# EasyEDA schematic MeinMarlin.json

## Sheets
1 STEPPER: TITLE: Sheet_1; REV: 1.0; Date: 2020-07-07; Sheet: 1/1; Drawn By: LindnerM; Company: Your Company
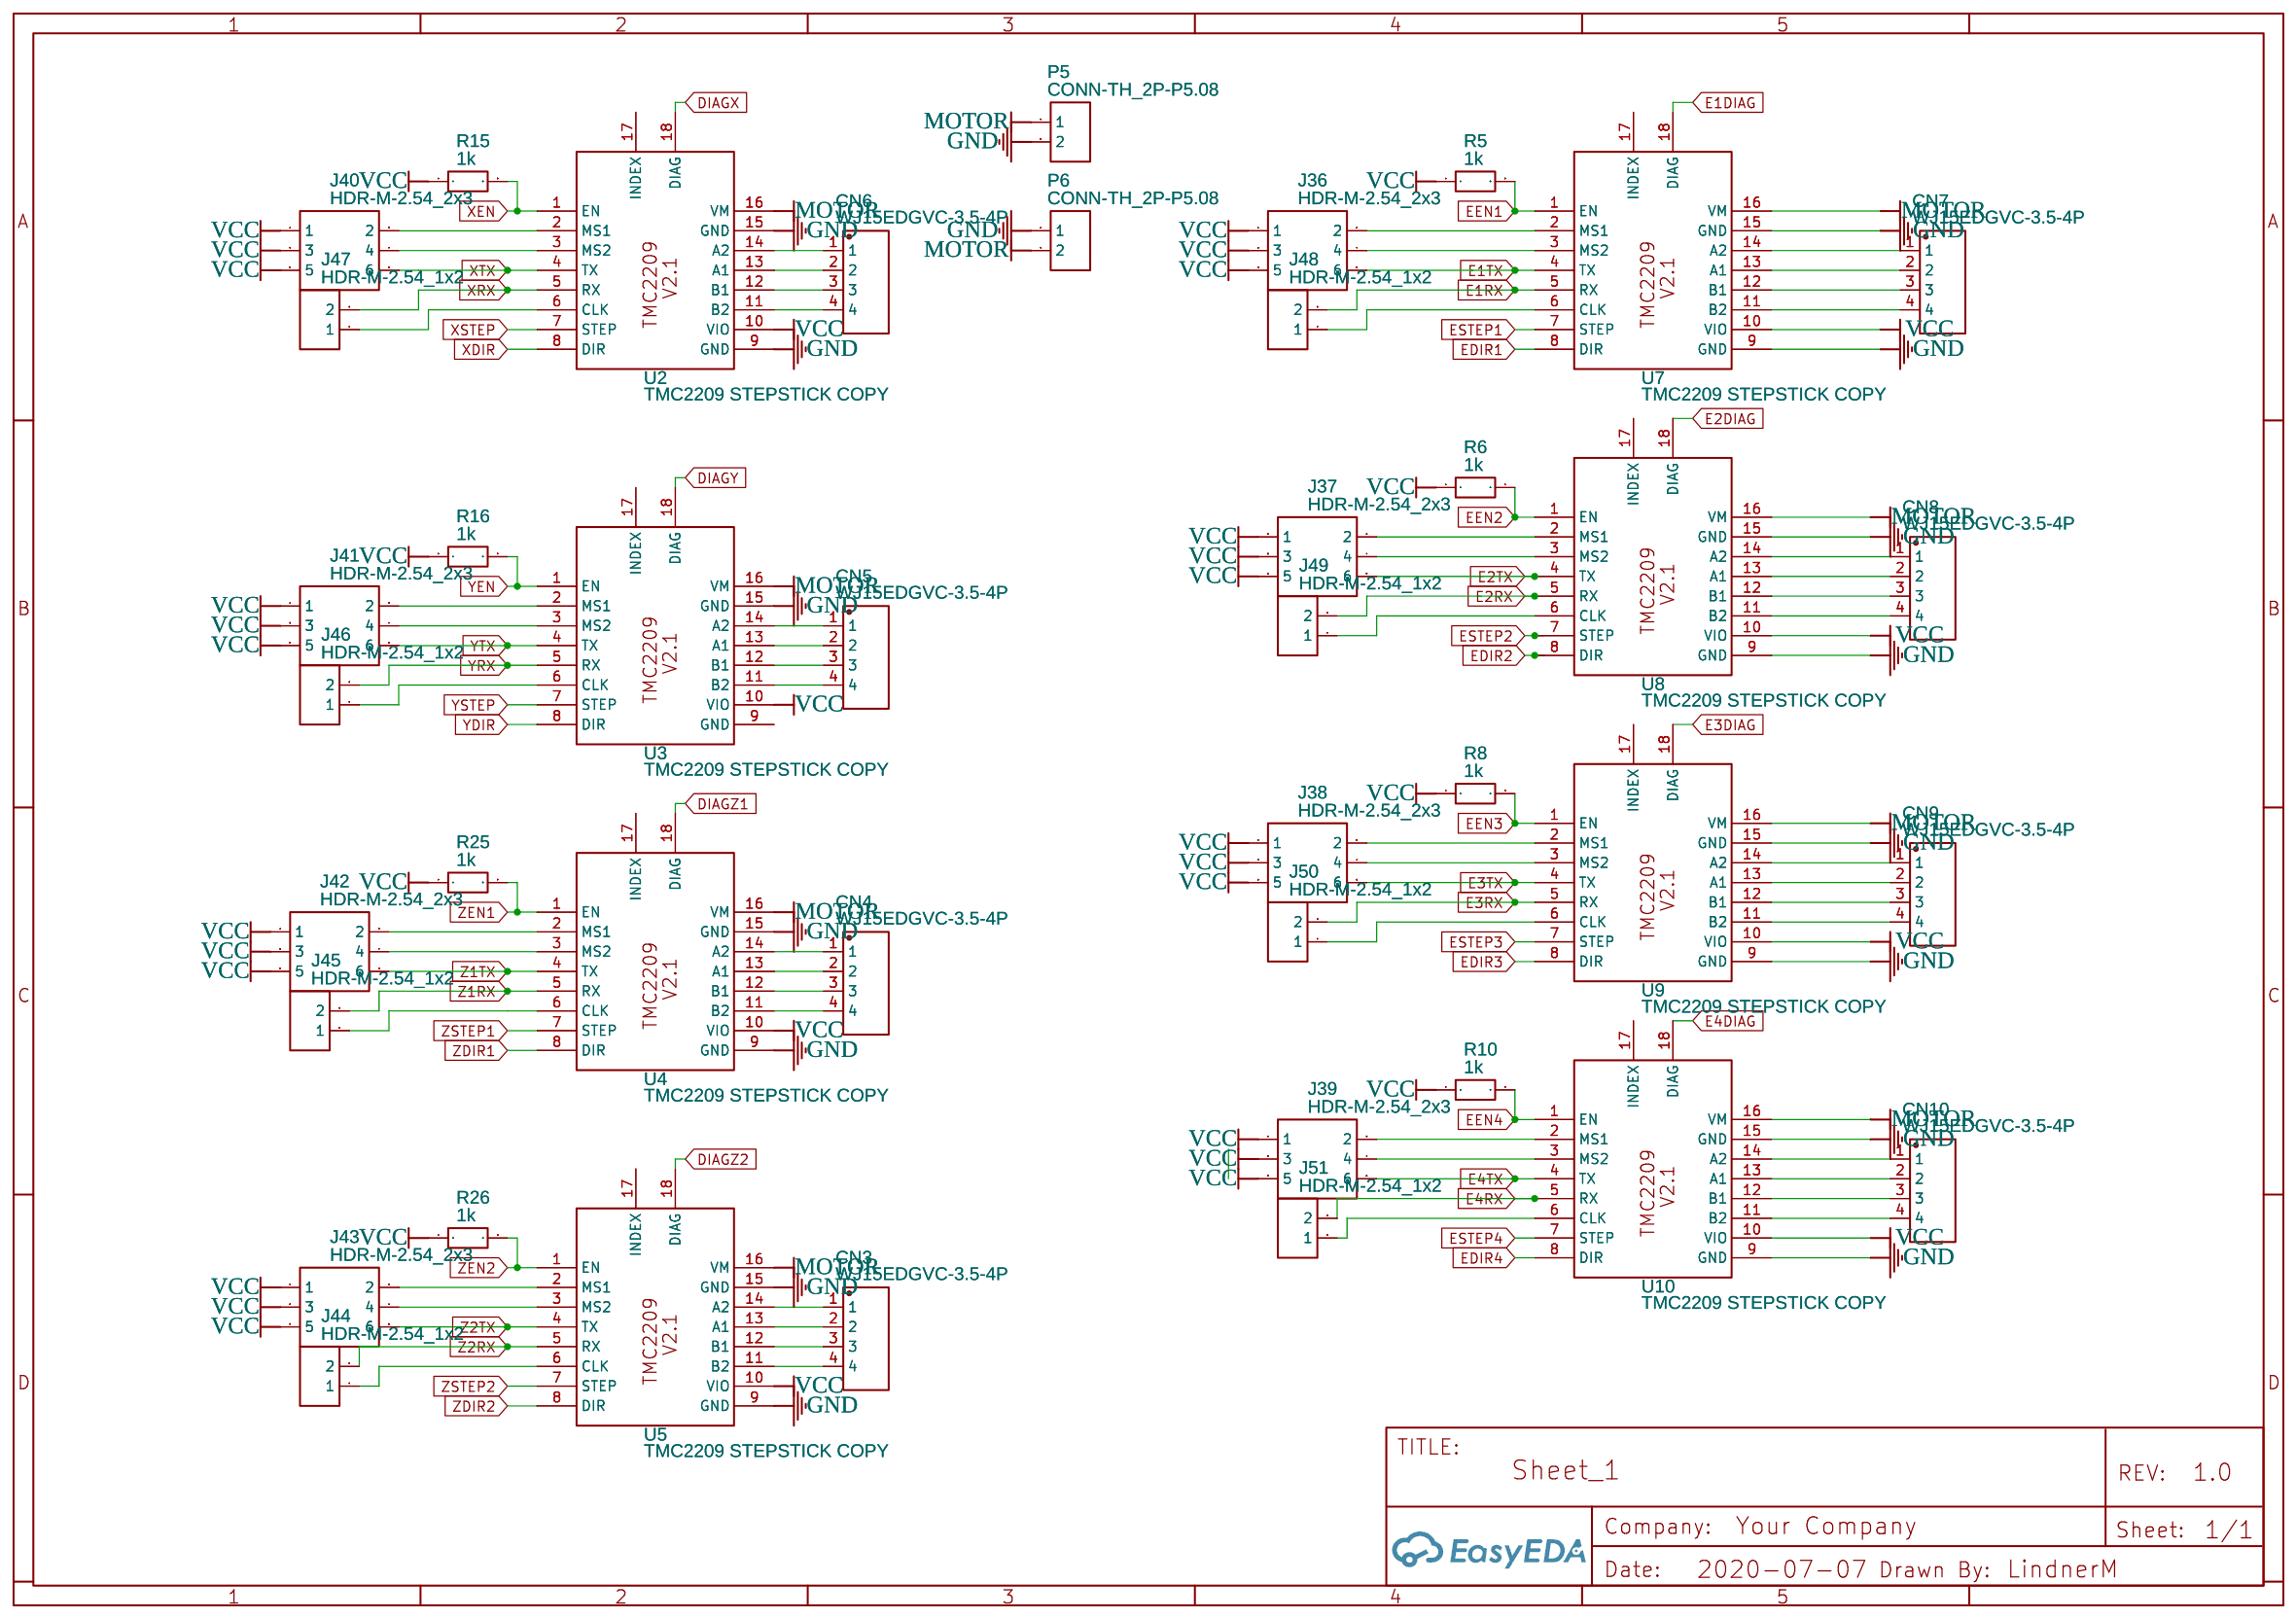
[diagram p0: STEPPER]
2 FAN_HEAT_TEMP: TITLE: Sheet_2; Date: 2020-07-08
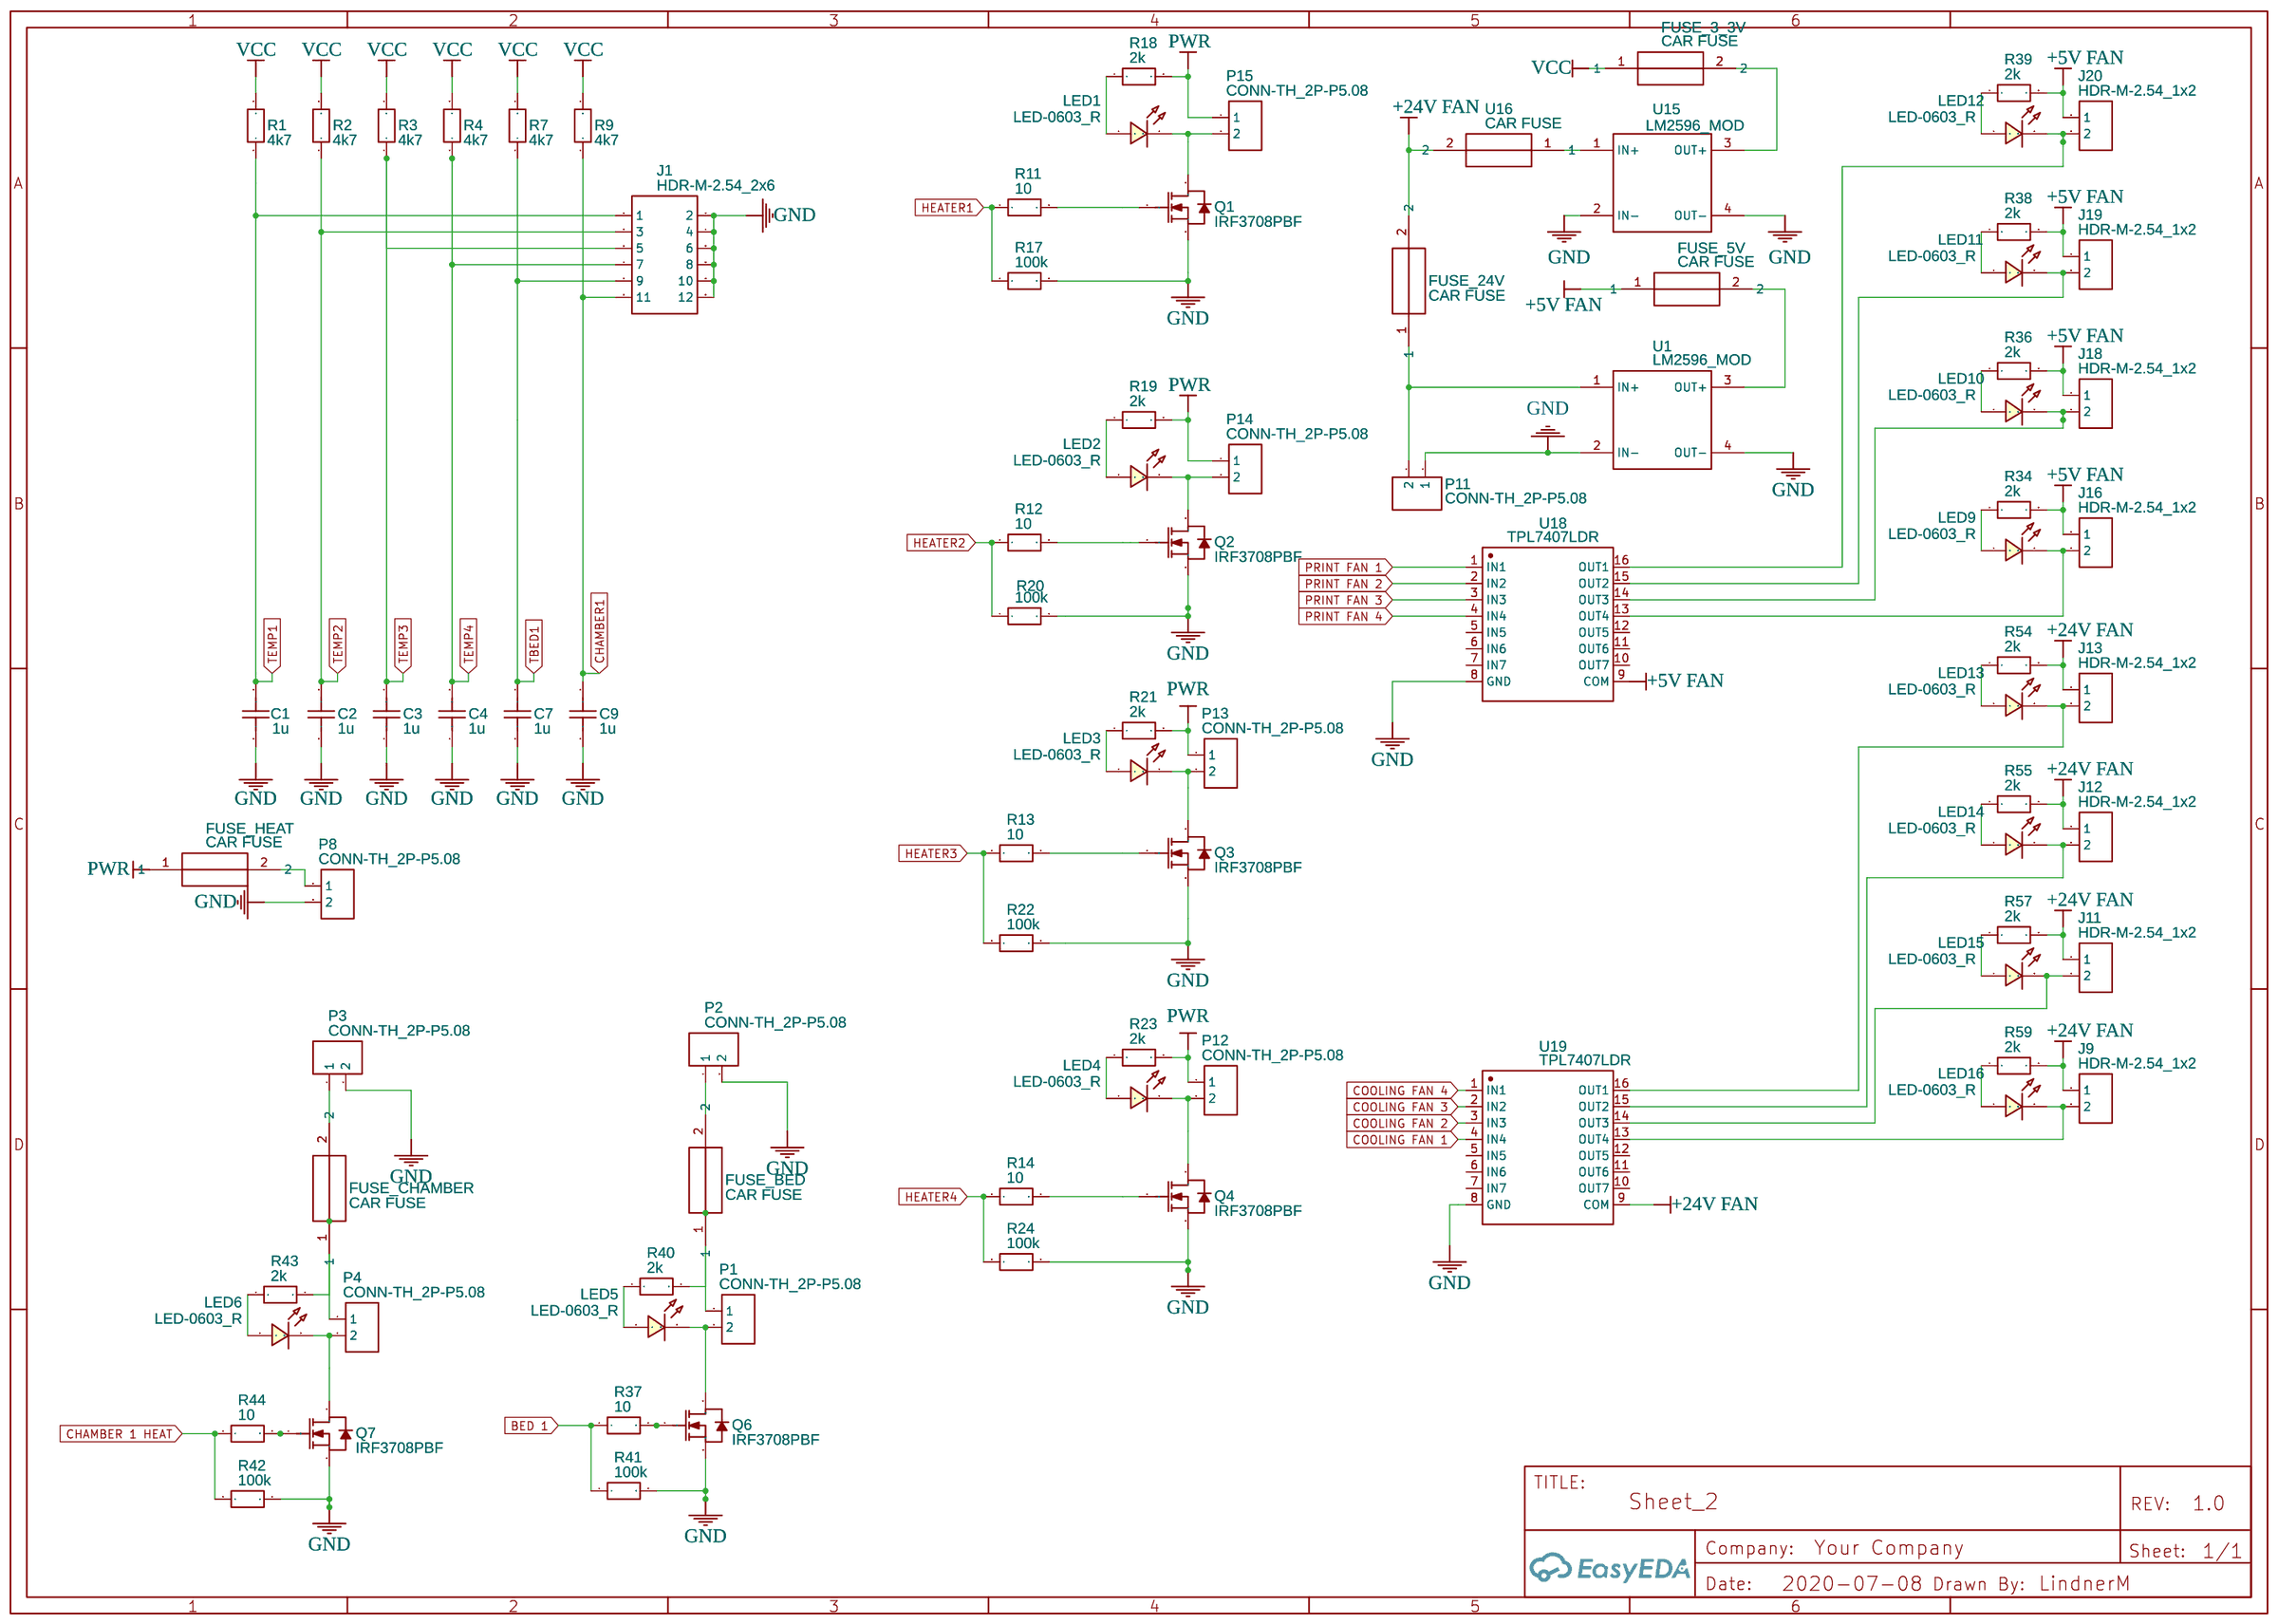
[diagram p1: FAN_HEAT_TEMP]
3 SENSOR: TITLE: Sheet_3; Date: 2020-07-08
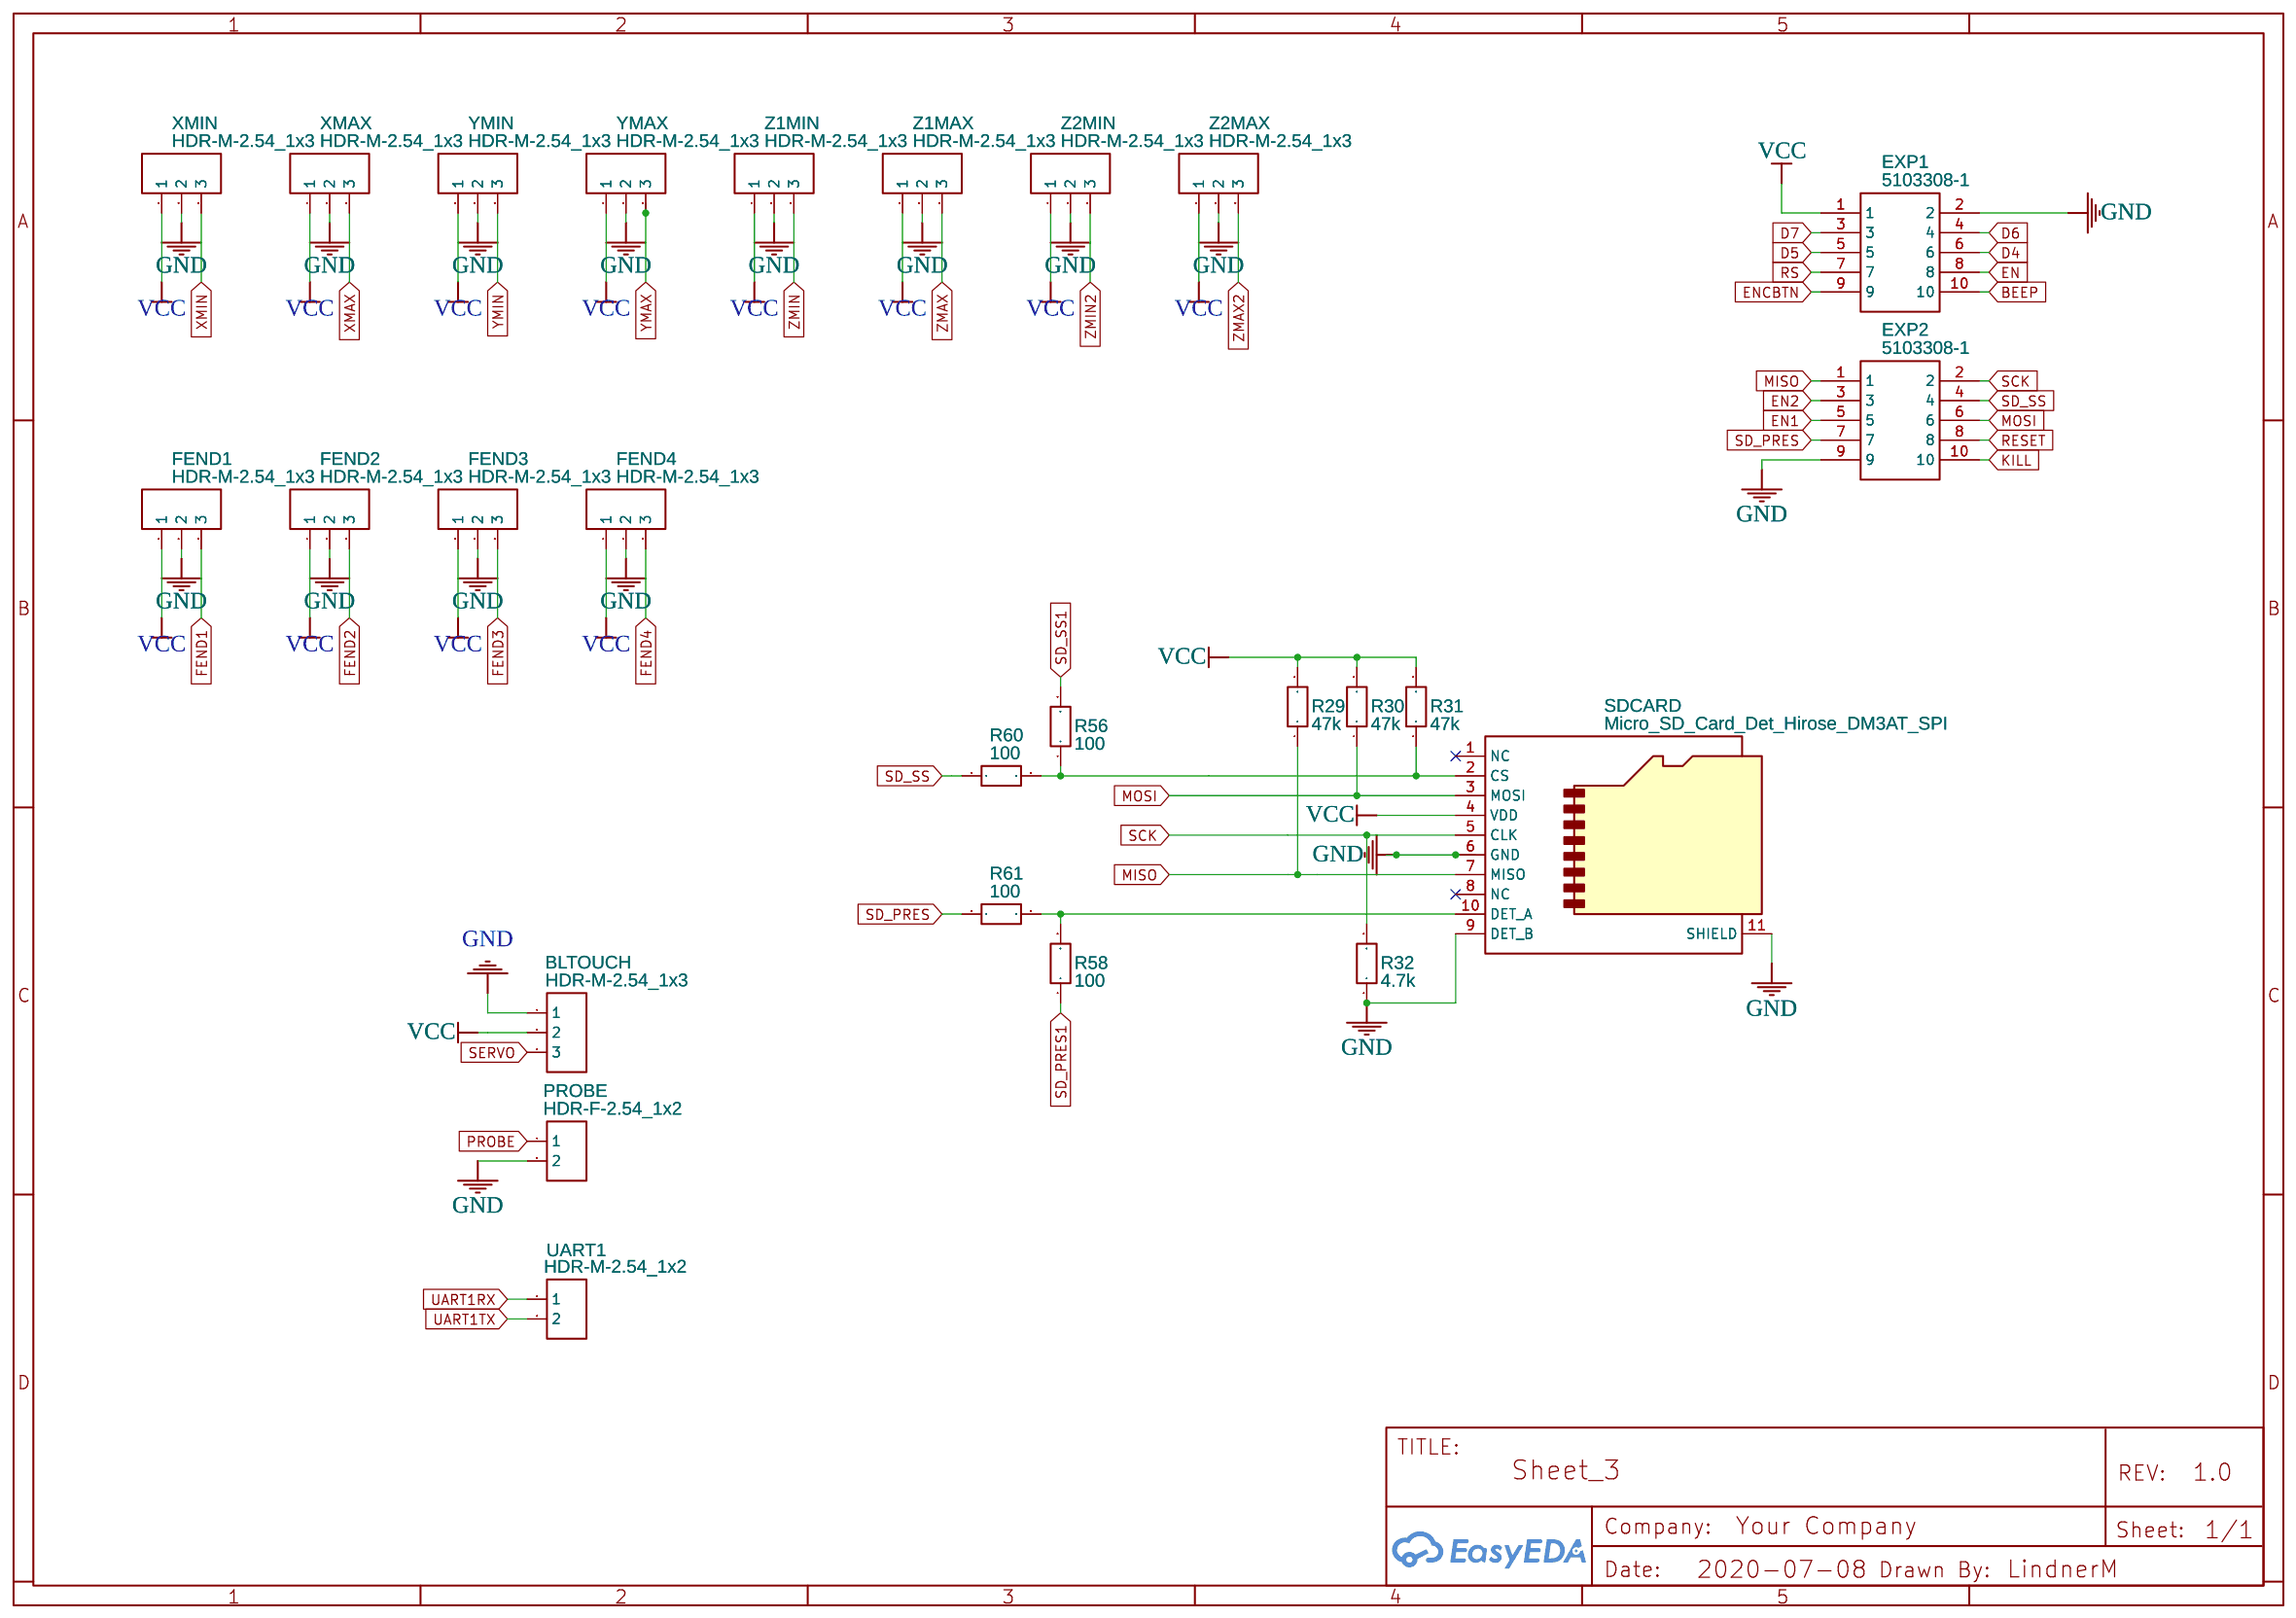
[diagram p2: SENSOR]
4 MCU: TITLE: Sheet_2; Date: 2020-07-17
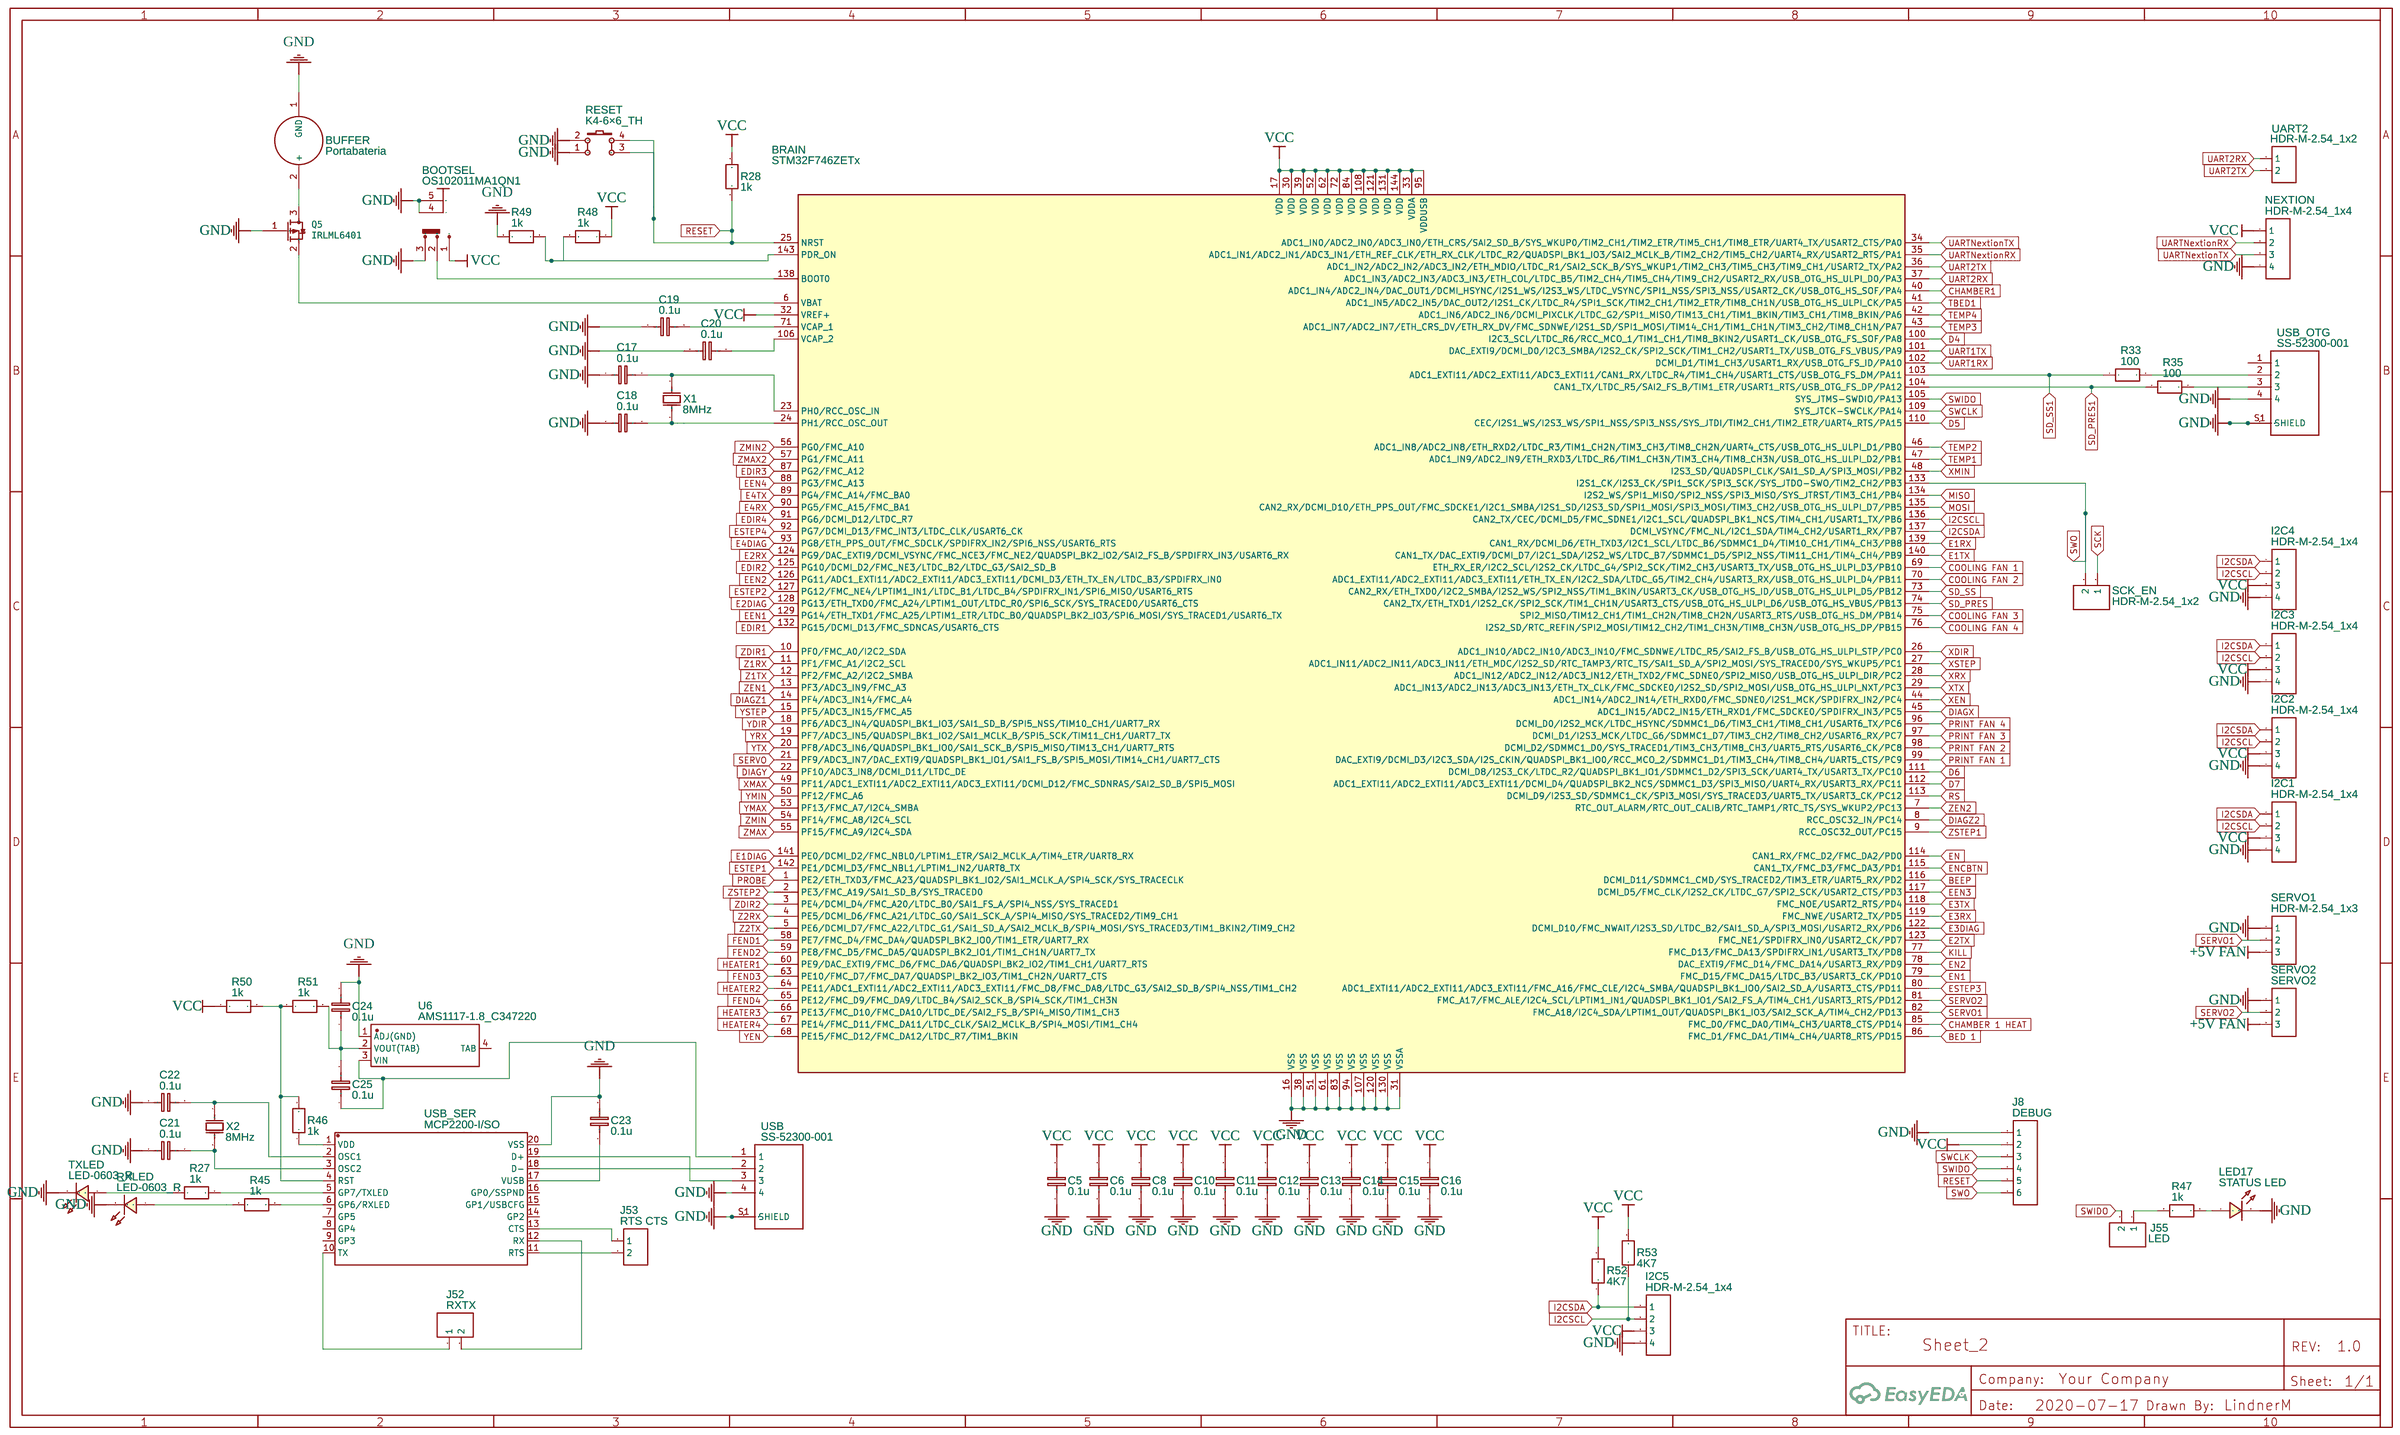
[diagram p3: MCU]

## Parts
sheet FAN_HEAT_TEMP
C1  1u  [C1206]
C2  1u  [C1206]
C3  1u  [C1206]
C4  1u  [C1206]
C7  1u  [C1206]
C9  1u  [C1206]
FUSE_3_3V  CAR FUSE  [SICHERUNG]
FUSE_5V  CAR FUSE  [SICHERUNG]
FUSE_24V  CAR FUSE  [SICHERUNG]
FUSE_BED  CAR FUSE  [SICHERUNG]
FUSE_CHAMBER  CAR FUSE  [SICHERUNG]
FUSE_HEAT  CAR FUSE  [SICHERUNG]
J1  HDR-M-2.54_2x6  [HDR-M-2.54_2X6]
J9  HDR-M-2.54_1x2  [HDR-M-2.54_1X2]
J11  HDR-M-2.54_1x2  [HDR-M-2.54_1X2]
J12  HDR-M-2.54_1x2  [HDR-M-2.54_1X2]
J13  HDR-M-2.54_1x2  [HDR-M-2.54_1X2]
J16  HDR-M-2.54_1x2  [HDR-M-2.54_1X2]
J18  HDR-M-2.54_1x2  [HDR-M-2.54_1X2]
J19  HDR-M-2.54_1x2  [HDR-M-2.54_1X2]
J20  HDR-M-2.54_1x2  [HDR-M-2.54_1X2]
LED1  LED-0603_R  [LED1206-RD]
LED2  LED-0603_R  [LED1206-RD]
LED3  LED-0603_R  [LED1206-RD]
LED4  LED-0603_R  [LED1206-RD]
LED5  LED-0603_R  [LED1206-RD]
LED6  LED-0603_R  [LED1206-RD]
LED9  LED-0603_R  [LED1206-RD]
LED10  LED-0603_R  [LED1206-RD]
LED11  LED-0603_R  [LED1206-RD]
LED12  LED-0603_R  [LED1206-RD]
LED13  LED-0603_R  [LED1206-RD]
LED14  LED-0603_R  [LED1206-RD]
LED15  LED-0603_R  [LED1206-RD]
LED16  LED-0603_R  [LED1206-RD]
P1  CONN-TH_2P-P5.08  [CONN-TH_2P-P5.08]
P2  CONN-TH_2P-P5.08  [CONN-TH_2P-P5.08]
P3  CONN-TH_2P-P5.08  [CONN-TH_2P-P5.08]
P4  CONN-TH_2P-P5.08  [CONN-TH_2P-P5.08]
P8  CONN-TH_2P-P5.08  [CONN-TH_2P-P5.08]
P11  CONN-TH_2P-P5.08  [CONN-TH_2P-P5.08]
P12  CONN-TH_2P-P5.08  [CONN-TH_2P-P5.08]
P13  CONN-TH_2P-P5.08  [CONN-TH_2P-P5.08]
P14  CONN-TH_2P-P5.08  [CONN-TH_2P-P5.08]
P15  CONN-TH_2P-P5.08  [CONN-TH_2P-P5.08]
Q1  IRF3708PBF  [TO-220-3_L10.0-W4.5-P2.54-L]
Q2  IRF3708PBF  [TO-220-3_L10.0-W4.5-P2.54-L]
Q3  IRF3708PBF  [TO-220-3_L10.0-W4.5-P2.54-L]
Q4  IRF3708PBF  [TO-220-3_L10.0-W4.5-P2.54-L]
Q6  IRF3708PBF  [TO-220-3_L10.0-W4.5-P2.54-L]
Q7  IRF3708PBF  [TO-220-3_L10.0-W4.5-P2.54-L]
R1  4k7  [R1206]
R2  4k7  [R1206]
R3  4k7  [R1206]
R4  4k7  [R1206]
R7  4k7  [R1206]
R9  4k7  [R1206]
R11  10  [R1206]
R12  10  [R1206]
R13  10  [R1206]
R14  10  [R1206]
R17  100k  [R1206]
R18  2k  [R1206]
R19  2k  [R1206]
R20  100k  [R1206]
R21  2k  [R1206]
R22  100k  [R1206]
R23  2k  [R1206]
R24  100k  [R1206]
R34  2k  [R1206]
R36  2k  [R1206]
R37  10  [R1206]
R38  2k  [R1206]
R39  2k  [R1206]
R40  2k  [R1206]
R41  100k  [R1206]
R42  100k  [R1206]
R43  2k  [R1206]
R44  10  [R1206]
R54  2k  [R1206]
R55  2k  [R1206]
R57  2k  [R1206]
R59  2k  [R1206]
U1  LM2596_MOD  [LM2596S EBAY]
U15  LM2596_MOD  [LM2596S EBAY]
U16  CAR FUSE  [SICHERUNG]
U18  TPL7407LDR  [SOIC-16_L9.9-W3.9-P1.27-LS6.0-BL]
U19  TPL7407LDR  [SOIC-16_L9.9-W3.9-P1.27-LS6.0-BL]
sheet MCU
BOOTSEL  OS102011MA1QN1  [SW-TH_OS102011MA1QN1]
BRAIN  STM32F746ZETx  [LQFP144]
BUFFER  Portabateria  [PORTABATERIA]
C5  0.1u  [C1206]
C6  0.1u  [C1206]
C8  0.1u  [C1206]
C10  0.1u  [C1206]
C11  0.1u  [C1206]
C12  0.1u  [C1206]
C13  0.1u  [C1206]
C14  0.1u  [C1206]
C15  0.1u  [C1206]
C16  0.1u  [C1206]
C17  0.1u  [C1206]
C18  0.1u  [C1206]
C19  0.1u  [C1206]
C20  0.1u  [C1206]
C21  0.1u  [C1206]
C22  0.1u  [C1206]
C23  0.1u  [C1206]
C24  0.1u  [C1206]
C25  0.1u  [C1206]
I2C1  HDR-M-2.54_1x4  [HDR-M-2.54_1X4]
I2C2  HDR-M-2.54_1x4  [HDR-M-2.54_1X4]
I2C3  HDR-M-2.54_1x4  [HDR-M-2.54_1X4]
I2C4  HDR-M-2.54_1x4  [HDR-M-2.54_1X4]
I2C5  HDR-M-2.54_1x4  [HDR-M-2.54_1X4]
J8  DEBUG  [HDR-M-2.54_1X6]
J52  RXTX  [HDR-M-2.54_1X2]
J53  RTS CTS  [HDR-M-2.54_1X2]
J55  LED  [HDR-M-2.54_1X2]
LED17  STATUS LED  [LED1206-RD]
NEXTION  HDR-M-2.54_1x4  [HDR-M-2.54_1X4]
Q5  IRLML6401  [SOT-23]
R27  1k  [R1206]
R28  1k  [R1206]
R33  100  [R1206]
R35  100  [R1206]
R45  1k  [R1206]
R46  1k  [R1206]
R47  1k  [R1206]
R48  1k  [R1206]
R49  1k  [R1206]
R50  1k  [R1206]
R51  1k  [R1206]
R52  4K7  [R1206]
R53  4K7  [R1206]
RESET  K4-6×6_TH  [KEY-TH_4P-L6.0-W6.0-P4.50-LS6.5]
RXLED  LED-0603_R  [LED1206-RD]
SCK_EN  HDR-M-2.54_1x2  [HDR-M-2.54_1X2]
SERVO1  HDR-M-2.54_1x3  [HDR-M-2.54_1X3]
SERVO2  SERVO2  [HDR-M-2.54_1X3]
TXLED  LED-0603_R  [LED1206-RD]
U6  AMS1117-1.8_C347220  [SOT-223_L6.7-W3.5-P2.30-BR]
UART2  HDR-M-2.54_1x2  [HDR-M-2.54_1X2]
USB  SS-52300-001  [BEL_SS-52300-001]
USB_OTG  SS-52300-001  [BEL_SS-52300-001]
USB_SER  MCP2200-I/SO  [SOIC-20_L13.0-W7.6-P1.27-LS10.6-BL]
X1  8MHz  [HC-49SMD]
X2  8MHz  [HC-49SMD]
sheet SENSOR
BLTOUCH  HDR-M-2.54_1x3  [HDR-M-2.54_1X3]
EXP1  5103308-1  [IDC-TH_5103308-1]
EXP2  5103308-1  [IDC-TH_5103308-1]
FEND1  HDR-M-2.54_1x3  [HDR-M-2.54_1X3]
FEND2  HDR-M-2.54_1x3  [HDR-M-2.54_1X3]
FEND3  HDR-M-2.54_1x3  [HDR-M-2.54_1X3]
FEND4  HDR-M-2.54_1x3  [HDR-M-2.54_1X3]
PROBE  HDR-F-2.54_1x2  [HDR-F-2.54_1X2]
R29  47k  [R1206]
R30  47k  [R1206]
R31  47k  [R1206]
R32  4.7k  [R1206]
R56  100  [R1206]
R58  100  [R1206]
R60  100  [R1206]
R61  100  [R1206]
SDCARD  Micro_SD_Card_Det_Hirose_DM3AT_SPI  [MICROSD_CARD_RECEPTACLE_HIROSE_DM3AT-SF-PEJM5 COPY]
UART1  HDR-M-2.54_1x2  [HDR-M-2.54_1X2]
XMAX  HDR-M-2.54_1x3  [HDR-M-2.54_1X3]
XMIN  HDR-M-2.54_1x3  [HDR-M-2.54_1X3]
YMAX  HDR-M-2.54_1x3  [HDR-M-2.54_1X3]
YMIN  HDR-M-2.54_1x3  [HDR-M-2.54_1X3]
Z1MAX  HDR-M-2.54_1x3  [HDR-M-2.54_1X3]
Z1MIN  HDR-M-2.54_1x3  [HDR-M-2.54_1X3]
Z2MAX  HDR-M-2.54_1x3  [HDR-M-2.54_1X3]
Z2MIN  HDR-M-2.54_1x3  [HDR-M-2.54_1X3]
sheet STEPPER
CN3  WJ15EDGVC-3.5-4P  [CON-TH_4PIN_WJ15EDGVC-3.5-4P]
CN4  WJ15EDGVC-3.5-4P  [CON-TH_4PIN_WJ15EDGVC-3.5-4P]
CN5  WJ15EDGVC-3.5-4P  [CON-TH_4PIN_WJ15EDGVC-3.5-4P]
CN6  WJ15EDGVC-3.5-4P  [CON-TH_4PIN_WJ15EDGVC-3.5-4P]
CN7  WJ15EDGVC-3.5-4P  [CON-TH_4PIN_WJ15EDGVC-3.5-4P]
CN8  WJ15EDGVC-3.5-4P  [CON-TH_4PIN_WJ15EDGVC-3.5-4P]
CN9  WJ15EDGVC-3.5-4P  [CON-TH_4PIN_WJ15EDGVC-3.5-4P]
CN10  WJ15EDGVC-3.5-4P  [CON-TH_4PIN_WJ15EDGVC-3.5-4P]
J36  HDR-M-2.54_2x3  [HDR-M-2.54_2X3]
J37  HDR-M-2.54_2x3  [HDR-M-2.54_2X3]
J38  HDR-M-2.54_2x3  [HDR-M-2.54_2X3]
J39  HDR-M-2.54_2x3  [HDR-M-2.54_2X3]
J40  HDR-M-2.54_2x3  [HDR-M-2.54_2X3]
J41  HDR-M-2.54_2x3  [HDR-M-2.54_2X3]
J42  HDR-M-2.54_2x3  [HDR-M-2.54_2X3]
J43  HDR-M-2.54_2x3  [HDR-M-2.54_2X3]
J44  HDR-M-2.54_1x2  [HDR-M-2.54_1X2]
J45  HDR-M-2.54_1x2  [HDR-M-2.54_1X2]
J46  HDR-M-2.54_1x2  [HDR-M-2.54_1X2]
J47  HDR-M-2.54_1x2  [HDR-M-2.54_1X2]
J48  HDR-M-2.54_1x2  [HDR-M-2.54_1X2]
J49  HDR-M-2.54_1x2  [HDR-M-2.54_1X2]
J50  HDR-M-2.54_1x2  [HDR-M-2.54_1X2]
J51  HDR-M-2.54_1x2  [HDR-M-2.54_1X2]
P5  CONN-TH_2P-P5.08  [CONN-TH_2P-P5.08]
P6  CONN-TH_2P-P5.08  [CONN-TH_2P-P5.08]
R5  1k  [R1206]
R6  1k  [R1206]
R8  1k  [R1206]
R10  1k  [R1206]
R15  1k  [R1206]
R16  1k  [R1206]
R25  1k  [R1206]
R26  1k  [R1206]
U2  TMC2209 STEPSTICK COPY  [TMC2209 V2.1 STEPSTICK]
U3  TMC2209 STEPSTICK COPY  [TMC2209 V2.1 STEPSTICK]
U4  TMC2209 STEPSTICK COPY  [TMC2209 V2.1 STEPSTICK]
U5  TMC2209 STEPSTICK COPY  [TMC2209 V2.1 STEPSTICK]
U7  TMC2209 STEPSTICK COPY  [TMC2209 V2.1 STEPSTICK]
U8  TMC2209 STEPSTICK COPY  [TMC2209 V2.1 STEPSTICK]
U9  TMC2209 STEPSTICK COPY  [TMC2209 V2.1 STEPSTICK]
U10  TMC2209 STEPSTICK COPY  [TMC2209 V2.1 STEPSTICK]

## Library data of the parts
C1-C4 C7 C9 = C_1206_US: Contributor: LCEDA_Lib
FUSE_3_3V FUSE_5V FUSE_24V FUSE_BED FUSE_CHAMBER FUSE_HEAT U16 = CAR FUSE: Manufacturer: IMAXX; Manufacturer Part: H1810-2X1; Supplier: REICHELT; Supplier Part: IMAXX H1810-2X1; link: https://www.reichelt.de/kfz-sicherungshalter-normoto-40-a-80-v-printmontage-imaxx-h1810-2x1-p229036.html?&trstct=pos_14&nbc=1; Contributor: LindnerM
J1 = HDR-M-2.54_2x6: Supplier Part: C124388; Supplier: LCSC; Contributor: LCEDA_Lib
J9 J11-J13 J16 J18-J20 J44-J53 J55 SCK_EN UART1 UART2 = HDR-M-2.54_1x2: Supplier Part: C124375; Supplier: LCSC; Contributor: LCEDA_Lib
LED1-LED6 LED9-LED17 RXLED TXLED = LED-0603_R: Manufacturer: EVERLIGHT(台湾亿光); Manufacturer Part: 19-217/R6C-AL1M2VY/3T; Supplier Part: C72044; Supplier: LCSC; Contributor: LCEDA_01
P1-P6 P8 P11-P15 = CONN-TH_2P-P5.08: Supplier: LCSC; Contributor: LCEDA_Lib
Q1-Q4 Q6 Q7 = IRF3708PBF: Supplier: LCSC; Supplier Part: C91100; Manufacturer: Infineon Technologies; Contributor: LCSC
R1-R4 R7 R9 R11-R14 R17-R24 R34 R36-R44 R54 R55 R57 R59 = R_0201_EU: Contributor: LCEDA_Lib
U1 U15 = LM2596_MOD: Manufacturer: EBAY generic; Manufacturer Part: LM2596S; Contributor: LindnerM
U18 U19 = TPL7407LDR: Supplier: LCSC; Manufacturer: TI; Contributor: LCSC; Supplier Part: C139663; LCSC Assembly: Yes; SMT Type: Extend
BOOTSEL = OS102011MA1QN1: Supplier: LCSC; Supplier Part: C226259; Manufacturer: C&K; Contributor: LCSC
BRAIN = STM32F746ZETx: Contributor: KiCAD; license: https://www.gnu.org/licenses/lgpl-2.1.html
BUFFER = Portabateria: Manufacturer: RENATA; Manufacturer Part: VBH2032-1; Contributor: kennyarth
C5 C6 C8 C10-C25 = C_1206_EU: Contributor: LCEDA_Lib
I2C1-I2C5 NEXTION = HDR-M-2.54_1x4: Supplier Part: C124378; Supplier: LCSC; Contributor: LCEDA_Lib
J8 = HDR-M-2.54_1x6: Supplier Part: C190819; Supplier: LCSC; Contributor: LCEDA_Lib
Q5 = -: Datasheet: https://www.infineon.com/dgdl/irlml6401pbf.pdf?fileId=5546d462533600a401535668b96d2634
R27-R33 R35 R45-R53 R56 R58 R60 R61 = R_1206_EU: Contributor: LCEDA_Lib
RESET = K4-6×6_TH: Supplier: LCSC; Supplier Part: C136684; Manufacturer: 韩国韩荣; Manufacturer Part: K2-1102DP-E4SW-04; Contributor: LCEDA_Lib
BLTOUCH FEND1-FEND4 SERVO1 SERVO2 XMAX XMIN YMAX YMIN Z1MAX Z1MIN Z2MAX Z2MIN = HDR-M-2.54_1x3: Supplier Part: C180248; Supplier: LCSC; Contributor: LCEDA_Lib
U6 = AMS1117-1.8_C347220: Supplier: LCSC; Supplier Part: C347220; Manufacturer: Youtai Semiconductor Co., Ltd.; Manufacturer Part: AMS1117-1.8; Contributor: LCSC; LCSC Assembly: Yes; SMT Type: Extend
USB USB_OTG = SS-52300-001: Contributor: Arpit Pradhan
USB_SER = MCP2200-I/SO: Supplier: LCSC; Supplier Part: C220734; Manufacturer: Microchip Tech; Contributor: LCSC; LCSC Assembly: Yes; SMT Type: Extend
X1 X2 = HC-49SM8MHz20pF30ppm: Supplier: LCSC; Manufacturer: TAE; Supplier Part: C107426
EXP1 EXP2 = 5103308-1: Supplier: LCSC; Manufacturer: TE Connectivity; Supplier Part: C86466
PROBE = HDR-F-2.54_1x2: Supplier Part: C49661; Supplier: LCSC; Contributor: LCEDA_Lib
SDCARD = Micro_SD_Card_Det_Hirose_DM3AT_SPI: Contributor: bendaner
CN3-CN10 = WJ15EDGVC-3.5-4P: Supplier: LCSC; Manufacturer: ReliaPro; Manufacturer Part: WJ15EDGVC-3.5-4Pneedle; image: //image.lceda.cn/szlcsc/C44917.jpg; Supplier Part: C44917
J36-J43 = HDR-M-2.54_2x3: Supplier Part: C65114; Supplier: LCSC; Contributor: LCEDA_Lib
R5 R6 R8 R10 R15 R16 R25 R26 = R_1210_EU: Contributor: LCEDA_Lib
U2-U5 U7-U10 = TMC2209 STEPSTICK COPY: Contributor: razzer_n

## Nets
+5V FAN: FUSE_5V.1 J16.1 J18.1 J19.1 J20.1 R34.2 R36.2 R38.2 R39.2 SERVO1.3 SERVO2.3 U18.9(COM)
+24V FAN: FUSE_24V.2 J9.1 J11.1 J12.1 J13.1 R54.2 R55.2 R57.2 R59.2 U16.2 U19.9(COM)
GND: BLTOUCH.1 BOOTSEL.3 BOOTSEL.4 BOOTSEL.5 BRAIN.16(VSS) BRAIN.31(VSSA) BRAIN.38(VSS) BRAIN.51(VSS) BRAIN.61(VSS) BRAIN.83(VSS) BRAIN.94(VSS) BRAIN.107(VSS) BRAIN.120(VSS) BRAIN.130(VSS) BUFFER.1(GND) C1.1 C2.1 C3.1 C4.1 C5.1 C6.1 C7.1 C8.1 C9.1 C10.1 C11.1 C12.1 C13.1 C14.1 C15.1 C16.1 C17.1 C18.1 C19.1 C20.1 C21.1 C22.1 C23.2 C24.2 EXP1.2 EXP2.9 FEND1.2 FEND2.2 FEND3.2 FEND4.2 I2C1.4 I2C2.4 I2C3.4 I2C4.4 I2C5.4 J1.2 J1.4 J1.6 J1.8 J1.10 J1.12 J8.1 LED17.2 NEXTION.4 P2.2 P3.2 P5.2 P6.1 P8.2 P11.1 PROBE.2 Q1.3(S) Q2.3(S) Q3.3(S) Q4.3(S) Q5.1(G) Q6.3(S) Q7.3(S) R17.2 R20.2 R22.2 R24.2 R32.1 R41.2 R42.2 R49.2 RESET.1 RESET.2 RXLED.2 SDCARD.6(GND) SDCARD.9(DET_B) SDCARD.11(SHIELD) SERVO1.1 SERVO2.1 TXLED.2 U1.2(IN-) U1.4(OUT-) U2.9(GND) U2.15(GND) U3.15(GND) U4.9(GND) U4.15(GND) U5.9(GND) U5.15(GND) U6.1(ADJ(GND)) U7.9(GND) U7.15(GND) U8.9(GND) U8.15(GND) U9.9(GND) U9.15(GND) U10.9(GND) U10.15(GND) U15.2(IN-) U15.4(OUT-) U18.8(GND) U19.8(GND) USB.4 USB.S1(SHIELD) USB.S2(SHIELD) USB_OTG.4 USB_OTG.S1(SHIELD) USB_OTG.S2(SHIELD) USB_SER.20(VSS) XMAX.2 XMIN.2 YMAX.2 YMIN.2 Z1MAX.2 Z1MIN.2 Z2MAX.2 Z2MIN.2
VCC: BLTOUCH.2 BOOTSEL.1 BRAIN.17(VDD) BRAIN.30(VDD) BRAIN.32(VREF+) BRAIN.33(VDDA) BRAIN.39(VDD) BRAIN.52(VDD) BRAIN.62(VDD) BRAIN.72(VDD) BRAIN.84(VDD) BRAIN.95(VDDUSB) BRAIN.108(VDD) BRAIN.121(VDD) BRAIN.131(VDD) BRAIN.144(VDD) C5.2 C6.2 C8.2 C10.2 C11.2 C12.2 C13.2 C14.2 C15.2 C16.2 EXP1.1 FEND1.1 FEND2.1 FEND3.1 FEND4.1 FUSE_3_3V.1 I2C1.3 I2C2.3 I2C3.3 I2C4.3 I2C5.3 J8.2 J36.1 J36.3 J36.5 J37.1 J37.3 J37.5 J38.1 J38.3 J38.5 J39.1 J39.3 J39.5 J40.1 J40.3 J40.5 J41.1 J41.3 J41.5 J42.1 J42.3 J42.5 J43.1 J43.3 J43.5 NEXTION.1 R1.2 R2.2 R3.2 R4.2 R5.1 R6.1 R7.2 R8.1 R9.2 R10.1 R15.1 R16.1 R25.1 R26.1 R28.2 R29.2 R30.2 R31.2 R48.1 R50.1 R52.2 R53.2 SDCARD.4(VDD) U2.10(VIO) U3.10(VIO) U4.10(VIO) U5.10(VIO) U7.10(VIO) U8.10(VIO) U9.10(VIO) U10.10(VIO) XMAX.1 XMIN.1 YMAX.1 YMIN.1 Z1MAX.1 Z1MIN.1 Z2MAX.1 Z2MIN.1
BED 1: BRAIN.86(FMC_D1/FMC_DA1/TIM4_CH4/UART8_RTS/PD15) R37.1 R41.1
BEEP: BRAIN.116(DCMI_D11/SDMMC1_CMD/SYS_TRACED2/TIM3_ETR/UART5_RX/PD2) EXP1.10
CHAMBER1: BRAIN.40(ADC1_IN4/ADC2_IN4/DAC_OUT1/DCMI_HSYNC/I2S1_WS/I2S3_WS/LTDC_VSYNC/SPI1_NSS/SPI3_NSS/USART2_CK/USB_OTG_HS_SOF/PA4) C9.2 J1.11 R9.1
CHAMBER 1 HEAT: BRAIN.85(FMC_D0/FMC_DA0/TIM4_CH3/UART8_CTS/PD14) R42.1 R44.1
COOLING FAN 1: BRAIN.69(ETH_RX_ER/I2C2_SCL/I2S2_CK/LTDC_G4/SPI2_SCK/TIM2_CH3/USART3_TX/USB_OTG_HS_ULPI_D3/PB10) U19.4(IN4)
COOLING FAN 2: BRAIN.70(ADC1_EXTI11/ADC2_EXTI11/ADC3_EXTI11/ETH_TX_EN/I2C2_SDA/LTDC_G5/TIM2_CH4/USART3_RX/USB_OTG_HS_ULPI_D4/PB11) U19.3(IN3)
COOLING FAN 3: BRAIN.75(SPI2_MISO/TIM12_CH1/TIM1_CH2N/TIM8_CH2N/USART3_RTS/USB_OTG_HS_DM/PB14) U19.2(IN2)
COOLING FAN 4: BRAIN.76(I2S2_SD/RTC_REFIN/SPI2_MOSI/TIM12_CH2/TIM1_CH3N/TIM8_CH3N/USB_OTG_HS_DP/PB15) U19.1(IN1)
D4: BRAIN.100(I2C3_SCL/LTDC_R6/RCC_MCO_1/TIM1_CH1/TIM8_BKIN2/USART1_CK/USB_OTG_FS_SOF/PA8) EXP1.6
D5: BRAIN.110(CEC/I2S1_WS/I2S3_WS/SPI1_NSS/SPI3_NSS/SYS_JTDI/TIM2_CH1/TIM2_ETR/UART4_RTS/PA15) EXP1.5
D6: BRAIN.111(DCMI_D8/I2S3_CK/LTDC_R2/QUADSPI_BK1_IO1/SDMMC1_D2/SPI3_SCK/UART4_TX/USART3_TX/PC10) EXP1.4
D7: BRAIN.112(ADC1_EXTI11/ADC2_EXTI11/ADC3_EXTI11/DCMI_D4/QUADSPI_BK2_NCS/SDMMC1_D3/SPI3_MISO/UART4_RX/USART3_RX/PC11) EXP1.3
DIAGX: BRAIN.45(ADC1_IN15/ADC2_IN15/ETH_RXD1/FMC_SDCKE0/SPDIFRX_IN3/PC5) U2.18(DIAG)
DIAGY: BRAIN.22(PF10/ADC3_IN8/DCMI_D11/LTDC_DE) U3.18(DIAG)
DIAGZ1: BRAIN.14(PF4/ADC3_IN14/FMC_A4) U4.18(DIAG)
DIAGZ2: BRAIN.8(RCC_OSC32_IN/PC14) U5.18(DIAG)
E1DIAG: BRAIN.141(PE0/DCMI_D2/FMC_NBL0/LPTIM1_ETR/SAI2_MCLK_A/TIM4_ETR/UART8_RX) U7.18(DIAG)
E1RX: BRAIN.139(CAN1_RX/DCMI_D6/ETH_TXD3/I2C1_SCL/LTDC_B6/SDMMC1_D4/TIM10_CH1/TIM4_CH3/PB8) J48.2 U7.5(RX)
E1TX: BRAIN.140(CAN1_TX/DAC_EXTI9/DCMI_D7/I2C1_SDA/I2S2_WS/LTDC_B7/SDMMC1_D5/SPI2_NSS/TIM11_CH1/TIM4_CH4/PB9) J36.6 U7.4(TX)
E2DIAG: BRAIN.128(PG13/ETH_TXD0/FMC_A24/LPTIM1_OUT/LTDC_R0/SPI6_SCK/SYS_TRACED0/USART6_CTS) U8.18(DIAG)
E2RX: BRAIN.124(PG9/DAC_EXTI9/DCMI_VSYNC/FMC_NCE3/FMC_NE2/QUADSPI_BK2_IO2/SAI2_FS_B/SPDIFRX_IN3/USART6_RX) J49.2 U8.5(RX)
E2TX: BRAIN.123(FMC_NE1/SPDIFRX_IN0/USART2_CK/PD7) J37.6 U8.4(TX)
E3DIAG: BRAIN.122(DCMI_D10/FMC_NWAIT/I2S3_SD/LTDC_B2/SAI1_SD_A/SPI3_MOSI/USART2_RX/PD6) U9.18(DIAG)
E3RX: BRAIN.119(FMC_NWE/USART2_TX/PD5) J50.2 U9.5(RX)
E3TX: BRAIN.118(FMC_NOE/USART2_RTS/PD4) J38.6 U9.4(TX)
E4DIAG: BRAIN.93(PG8/ETH_PPS_OUT/FMC_SDCLK/SPDIFRX_IN2/SPI6_NSS/USART6_RTS) U10.18(DIAG)
E4RX: BRAIN.90(PG5/FMC_A15/FMC_BA1) J51.2 U10.5(RX)
E4TX: BRAIN.89(PG4/FMC_A14/FMC_BA0) J39.6 U10.4(TX)
EDIR1: BRAIN.132(PG15/DCMI_D13/FMC_SDNCAS/USART6_CTS) U7.8(DIR)
EDIR2: BRAIN.125(PG10/DCMI_D2/FMC_NE3/LTDC_B2/LTDC_G3/SAI2_SD_B) U8.8(DIR)
EDIR3: BRAIN.87(PG2/FMC_A12) U9.8(DIR)
EDIR4: BRAIN.91(PG6/DCMI_D12/LTDC_R7) U10.8(DIR)
EEN1: BRAIN.129(PG14/ETH_TXD1/FMC_A25/LPTIM1_ETR/LTDC_B0/QUADSPI_BK2_IO3/SPI6_MOSI/SYS_TRACED1/USART6_TX) R5.2 U7.1(EN)
EEN2: BRAIN.126(PG11/ADC1_EXTI11/ADC2_EXTI11/ADC3_EXTI11/DCMI_D3/ETH_TX_EN/LTDC_B3/SPDIFRX_IN0) R6.2 U8.1(EN)
EEN3: BRAIN.117(DCMI_D5/FMC_CLK/I2S2_CK/LTDC_G7/SPI2_SCK/USART2_CTS/PD3) R8.2 U9.1(EN)
EEN4: BRAIN.88(PG3/FMC_A13) R10.2 U10.1(EN)
EN: BRAIN.114(CAN1_RX/FMC_D2/FMC_DA2/PD0) EXP1.8
EN1: BRAIN.79(FMC_D15/FMC_DA15/LTDC_B3/USART3_CK/PD10) EXP2.5
EN2: BRAIN.78(DAC_EXTI9/FMC_D14/FMC_DA14/USART3_RX/PD9) EXP2.3
ENCBTN: BRAIN.115(CAN1_TX/FMC_D3/FMC_DA3/PD1) EXP1.9
ESTEP1: BRAIN.142(PE1/DCMI_D3/FMC_NBL1/LPTIM1_IN2/UART8_TX) U7.7(STEP)
ESTEP2: BRAIN.127(PG12/FMC_NE4/LPTIM1_IN1/LTDC_B1/LTDC_B4/SPDIFRX_IN1/SPI6_MISO/USART6_RTS) U8.7(STEP)
ESTEP3: BRAIN.80(ADC1_EXTI11/ADC2_EXTI11/ADC3_EXTI11/FMC_A16/FMC_CLE/I2C4_SMBA/QUADSPI_BK1_IO0/SAI2_SD_A/USART3_CTS/PD11) U9.7(STEP)
ESTEP4: BRAIN.92(PG7/DCMI_D13/FMC_INT3/LTDC_CLK/USART6_CK) U10.7(STEP)
FEND1: BRAIN.58(PE7/FMC_D4/FMC_DA4/QUADSPI_BK2_IO0/TIM1_ETR/UART7_RX) FEND1.3
FEND2: BRAIN.59(PE8/FMC_D5/FMC_DA5/QUADSPI_BK2_IO1/TIM1_CH1N/UART7_TX) FEND2.3
FEND3: BRAIN.63(PE10/FMC_D7/FMC_DA7/QUADSPI_BK2_IO3/TIM1_CH2N/UART7_CTS) FEND3.3
FEND4: BRAIN.65(PE12/FMC_D9/FMC_DA9/LTDC_B4/SAI2_SCK_B/SPI4_SCK/TIM1_CH3N) FEND4.3
HEATER1: BRAIN.60(PE9/DAC_EXTI9/FMC_D6/FMC_DA6/QUADSPI_BK2_IO2/TIM1_CH1/UART7_RTS) R11.1 R17.1
HEATER2: BRAIN.64(PE11/ADC1_EXTI11/ADC2_EXTI11/ADC3_EXTI11/FMC_D8/FMC_DA8/LTDC_G3/SAI2_SD_B/SPI4_NSS/TIM1_CH2) R12.1 R20.1
HEATER3: BRAIN.66(PE13/FMC_D10/FMC_DA10/LTDC_DE/SAI2_FS_B/SPI4_MISO/TIM1_CH3) R13.1 R22.1
HEATER4: BRAIN.67(PE14/FMC_D11/FMC_DA11/LTDC_CLK/SAI2_MCLK_B/SPI4_MOSI/TIM1_CH4) R14.1 R24.1
I2CSCL: BRAIN.136(CAN2_TX/CEC/DCMI_D5/FMC_SDNE1/I2C1_SCL/QUADSPI_BK1_NCS/TIM4_CH1/USART1_TX/PB6) I2C1.2 I2C2.2 I2C3.2 I2C4.2 I2C5.2 R53.1
I2CSDA: BRAIN.137(DCMI_VSYNC/FMC_NL/I2C1_SDA/TIM4_CH2/USART1_RX/PB7) I2C1.1 I2C2.1 I2C3.1 I2C4.1 I2C5.1 R52.1
KILL: BRAIN.77(FMC_D13/FMC_DA13/SPDIFRX_IN1/USART3_TX/PD8) EXP2.10
MISO: BRAIN.134(I2S2_WS/SPI1_MISO/SPI2_NSS/SPI3_MISO/SYS_JTRST/TIM3_CH1/PB4) EXP2.1 R29.1 SDCARD.7(MISO)
MOSI: BRAIN.135(CAN2_RX/DCMI_D10/ETH_PPS_OUT/FMC_SDCKE1/I2C1_SMBA/I2S1_SD/I2S3_SD/SPI1_MOSI/SPI3_MOSI/TIM3_CH2/USB_OTG_HS_ULPI_D7/PB5) EXP2.6 R30.1 SDCARD.3(MOSI)
MOTOR: P5.1 P6.2 U2.16(VM) U3.16(VM) U4.16(VM) U5.16(VM) U7.16(VM) U8.16(VM) U9.16(VM) U10.16(VM)
PRINT FAN 1: BRAIN.99(DAC_EXTI9/DCMI_D3/I2C3_SDA/I2S_CKIN/QUADSPI_BK1_IO0/RCC_MCO_2/SDMMC1_D1/TIM3_CH4/TIM8_CH4/UART5_CTS/PC9) U18.1(IN1)
PRINT FAN 2: BRAIN.98(DCMI_D2/SDMMC1_D0/SYS_TRACED1/TIM3_CH3/TIM8_CH3/UART5_RTS/USART6_CK/PC8) U18.2(IN2)
PRINT FAN 3: BRAIN.97(DCMI_D1/I2S3_MCK/LTDC_G6/SDMMC1_D7/TIM3_CH2/TIM8_CH2/USART6_RX/PC7) U18.3(IN3)
PRINT FAN 4: BRAIN.96(DCMI_D0/I2S2_MCK/LTDC_HSYNC/SDMMC1_D6/TIM3_CH1/TIM8_CH1/USART6_TX/PC6) U18.4(IN4)
PROBE: BRAIN.1(PE2/ETH_TXD3/FMC_A23/QUADSPI_BK1_IO2/SAI1_MCLK_A/SPI4_SCK/SYS_TRACECLK) PROBE.1
PWR: FUSE_HEAT.1 P12.1 P13.1 P14.1 P15.1 R18.2 R19.2 R21.2 R23.2
RESET: BRAIN.25(NRST) EXP2.8 J8.5 R28.1 RESET.3 RESET.4
RS: BRAIN.113(DCMI_D9/I2S3_SD/SDMMC1_CK/SPI3_MOSI/SYS_TRACED3/UART5_TX/USART3_CK/PC12) EXP1.7
SCK: EXP2.2 R32.2 SCK_EN.1 SDCARD.5(CLK)
SD_PRES: BRAIN.74(CAN2_TX/ETH_TXD1/I2S2_CK/SPI2_SCK/TIM1_CH1N/USART3_CTS/USB_OTG_HS_ULPI_D6/USB_OTG_HS_VBUS/PB13) EXP2.7 R61.1
SD_PRES1: BRAIN.104(CAN1_TX/LTDC_R5/SAI2_FS_B/TIM1_ETR/USART1_RTS/USB_OTG_FS_DP/PA12) R35.1 R58.1
SD_SS: BRAIN.73(CAN2_RX/ETH_TXD0/I2C2_SMBA/I2S2_WS/SPI2_NSS/TIM1_BKIN/USART3_CK/USB_OTG_HS_ID/USB_OTG_HS_ULPI_D5/PB12) EXP2.4 R60.1
SD_SS1: BRAIN.103(ADC1_EXTI11/ADC2_EXTI11/ADC3_EXTI11/CAN1_RX/LTDC_R4/TIM1_CH4/USART1_CTS/USB_OTG_FS_DM/PA11) R33.1 R56.2
SERVO: BLTOUCH.3 BRAIN.21(PF9/ADC3_IN7/DAC_EXTI9/QUADSPI_BK1_IO1/SAI1_FS_B/SPI5_MOSI/TIM14_CH1/UART7_CTS)
SERVO1: BRAIN.82(FMC_A18/I2C4_SDA/LPTIM1_OUT/QUADSPI_BK1_IO3/SAI2_SCK_A/TIM4_CH2/PD13) SERVO1.2
SERVO2: BRAIN.81(FMC_A17/FMC_ALE/I2C4_SCL/LPTIM1_IN1/QUADSPI_BK1_IO1/SAI2_FS_A/TIM4_CH1/USART3_RTS/PD12) SERVO2.2
SWCLK: BRAIN.109(SYS_JTCK-SWCLK/PA14) J8.3
SWIDO: BRAIN.105(SYS_JTMS-SWDIO/PA13) J8.4 J55.2
SWO: BRAIN.133(I2S1_CK/I2S3_CK/SPI1_SCK/SPI3_SCK/SYS_JTDO-SWO/TIM2_CH2/PB3) J8.6 SCK_EN.2
TBED1: BRAIN.41(ADC1_IN5/ADC2_IN5/DAC_OUT2/I2S1_CK/LTDC_R4/SPI1_SCK/TIM2_CH1/TIM2_ETR/TIM8_CH1N/USB_OTG_HS_ULPI_CK/PA5) C7.2 J1.9 R7.1
TEMP1: BRAIN.47(ADC1_IN9/ADC2_IN9/ETH_RXD3/LTDC_R6/TIM1_CH3N/TIM3_CH4/TIM8_CH3N/USB_OTG_HS_ULPI_D2/PB1) C1.2 J1.1 R1.1
TEMP2: BRAIN.46(ADC1_IN8/ADC2_IN8/ETH_RXD2/LTDC_R3/TIM1_CH2N/TIM3_CH3/TIM8_CH2N/UART4_CTS/USB_OTG_HS_ULPI_D1/PB0) C2.2 J1.3 R2.1
TEMP3: BRAIN.43(ADC1_IN7/ADC2_IN7/ETH_CRS_DV/ETH_RX_DV/FMC_SDNWE/I2S1_SD/SPI1_MOSI/TIM14_CH1/TIM1_CH1N/TIM3_CH2/TIM8_CH1N/PA7) C3.2 J1.5 R3.1
TEMP4: BRAIN.42(ADC1_IN6/ADC2_IN6/DCMI_PIXCLK/LTDC_G2/SPI1_MISO/TIM13_CH1/TIM1_BKIN/TIM3_CH1/TIM8_BKIN/PA6) C4.2 J1.7 R4.1
UART1RX: BRAIN.102(DCMI_D1/TIM1_CH3/USART1_RX/USB_OTG_FS_ID/PA10) UART1.1
UART1TX: BRAIN.101(DAC_EXTI9/DCMI_D0/I2C3_SMBA/I2S2_CK/SPI2_SCK/TIM1_CH2/USART1_TX/USB_OTG_FS_VBUS/PA9) UART1.2
UART2RX: BRAIN.37(ADC1_IN3/ADC2_IN3/ADC3_IN3/ETH_COL/LTDC_B5/TIM2_CH4/TIM5_CH4/TIM9_CH2/USART2_RX/USB_OTG_HS_ULPI_D0/PA3) UART2.1
UART2TX: BRAIN.36(ADC1_IN2/ADC2_IN2/ADC3_IN2/ETH_MDIO/LTDC_R1/SAI2_SCK_B/SYS_WKUP1/TIM2_CH3/TIM5_CH3/TIM9_CH1/USART2_TX/PA2) UART2.2
UARTNextionRX: BRAIN.35(ADC1_IN1/ADC2_IN1/ADC3_IN1/ETH_REF_CLK/ETH_RX_CLK/LTDC_R2/QUADSPI_BK1_IO3/SAI2_MCLK_B/TIM2_CH2/TIM5_CH2/UART4_RX/USART2_RTS/PA1) NEXTION.2
UARTNextionTX: BRAIN.34(ADC1_IN0/ADC2_IN0/ADC3_IN0/ETH_CRS/SAI2_SD_B/SYS_WKUP0/TIM2_CH1/TIM2_ETR/TIM5_CH1/TIM8_ETR/UART4_TX/USART2_CTS/PA0) NEXTION.3
XDIR: BRAIN.26(ADC1_IN10/ADC2_IN10/ADC3_IN10/FMC_SDNWE/LTDC_R5/SAI2_FS_B/USB_OTG_HS_ULPI_STP/PC0) U2.8(DIR)
XEN: BRAIN.44(ADC1_IN14/ADC2_IN14/ETH_RXD0/FMC_SDNE0/I2S1_MCK/SPDIFRX_IN2/PC4) R15.2 U2.1(EN)
XMAX: BRAIN.49(PF11/ADC1_EXTI11/ADC2_EXTI11/ADC3_EXTI11/DCMI_D12/FMC_SDNRAS/SAI2_SD_B/SPI5_MOSI) XMAX.3
XMIN: BRAIN.48(I2S3_SD/QUADSPI_CLK/SAI1_SD_A/SPI3_MOSI/PB2) XMIN.3
XRX: BRAIN.28(ADC1_IN12/ADC2_IN12/ADC3_IN12/ETH_TXD2/FMC_SDNE0/SPI2_MISO/USB_OTG_HS_ULPI_DIR/PC2) J47.2 U2.5(RX)
XSTEP: BRAIN.27(ADC1_IN11/ADC2_IN11/ADC3_IN11/ETH_MDC/I2S2_SD/RTC_TAMP3/RTC_TS/SAI1_SD_A/SPI2_MOSI/SYS_TRACED0/SYS_WKUP5/PC1) U2.7(STEP)
XTX: BRAIN.29(ADC1_IN13/ADC2_IN13/ADC3_IN13/ETH_TX_CLK/FMC_SDCKE0/I2S2_SD/SPI2_MOSI/USB_OTG_HS_ULPI_NXT/PC3) J40.6 U2.4(TX)
YDIR: BRAIN.18(PF6/ADC3_IN4/QUADSPI_BK1_IO3/SAI1_SD_B/SPI5_NSS/TIM10_CH1/UART7_RX) U3.8(DIR)
YEN: BRAIN.68(PE15/FMC_D12/FMC_DA12/LTDC_R7/TIM1_BKIN) R16.2 U3.1(EN)
YMAX: BRAIN.53(PF13/FMC_A7/I2C4_SMBA) YMAX.3
YMIN: BRAIN.50(PF12/FMC_A6) YMIN.3
YRX: BRAIN.19(PF7/ADC3_IN5/QUADSPI_BK1_IO2/SAI1_MCLK_B/SPI5_SCK/TIM11_CH1/UART7_TX) J46.2 U3.5(RX)
YSTEP: BRAIN.15(PF5/ADC3_IN15/FMC_A5) U3.7(STEP)
YTX: BRAIN.20(PF8/ADC3_IN6/QUADSPI_BK1_IO0/SAI1_SCK_B/SPI5_MISO/TIM13_CH1/UART7_RTS) J41.6 U3.4(TX)
Z1RX: BRAIN.11(PF1/FMC_A1/I2C2_SCL) J45.2 U4.5(RX)
Z1TX: BRAIN.12(PF2/FMC_A2/I2C2_SMBA) J42.6 U4.4(TX)
Z2RX: BRAIN.4(PE5/DCMI_D6/FMC_A21/LTDC_G0/SAI1_SCK_A/SPI4_MISO/SYS_TRACED2/TIM9_CH1) J44.2 U5.5(RX)
Z2TX: BRAIN.5(PE6/DCMI_D7/FMC_A22/LTDC_G1/SAI1_SD_A/SAI2_MCLK_B/SPI4_MOSI/SYS_TRACED3/TIM1_BKIN2/TIM9_CH2) J43.6 U5.4(TX)
ZDIR1: BRAIN.10(PF0/FMC_A0/I2C2_SDA) U4.8(DIR)
ZDIR2: BRAIN.3(PE4/DCMI_D4/FMC_A20/LTDC_B0/SAI1_FS_A/SPI4_NSS/SYS_TRACED1) U5.8(DIR)
ZEN1: BRAIN.13(PF3/ADC3_IN9/FMC_A3) R25.2 U4.1(EN)
ZEN2: BRAIN.7(RTC_OUT_ALARM/RTC_OUT_CALIB/RTC_TAMP1/RTC_TS/SYS_WKUP2/PC13) R26.2 U5.1(EN)
ZMAX: BRAIN.55(PF15/FMC_A9/I2C4_SDA) Z1MAX.3
ZMAX2: BRAIN.57(PG1/FMC_A11) Z2MAX.3
ZMIN: BRAIN.54(PF14/FMC_A8/I2C4_SCL) Z1MIN.3
ZMIN2: BRAIN.56(PG0/FMC_A10) Z2MIN.3
ZSTEP1: BRAIN.9(RCC_OSC32_OUT/PC15) U4.7(STEP)
ZSTEP2: BRAIN.2(PE3/FMC_A19/SAI1_SD_B/SYS_TRACED0) U5.7(STEP)
Net-(BOOTSEL-2): BOOTSEL.2 BRAIN.138(BOOT0)
Net-(BRAIN-6): BRAIN.6(VBAT) Q5.2(S)
Net-(BRAIN-23): BRAIN.23(PH0/RCC_OSC_IN) C17.2 X1.1(OSC1)
Net-(BRAIN-24): BRAIN.24(PH1/RCC_OSC_OUT) C18.2 X1.2(OSC2)
Net-(BRAIN-71): BRAIN.71(VCAP_1) C19.2
Net-(BRAIN-106): BRAIN.106(VCAP_2) C20.2
Net-(BRAIN-143): BRAIN.143(PDR_ON) R48.2 R49.1
Net-(BUFFER-2): BUFFER.2(+) Q5.3(D)
Net-(C21-2): C21.2 USB_SER.3(OSC2) X2.2(OSC2)
Net-(C22-2): C22.2 USB_SER.2(OSC1) X2.1(OSC1)
Net-(C23-1): C23.1 USB_SER.17(VUSB)
Net-(C24-1): C24.1 C25.2 R51.2 U6.2(VOUT(TAB))
Net-(C25-1): C25.1 U6.3(VIN) USB.1
Net-(CN3-1): CN3.1 U5.14(A2)
Net-(CN3-2): CN3.2 U5.13(A1)
Net-(CN3-3): CN3.3 U5.12(B1)
Net-(CN3-4): CN3.4 U5.11(B2)
Net-(CN4-1): CN4.1 U4.14(A2)
Net-(CN4-2): CN4.2 U4.13(A1)
Net-(CN4-3): CN4.3 U4.12(B1)
Net-(CN4-4): CN4.4 U4.11(B2)
Net-(CN5-1): CN5.1 U3.14(A2)
Net-(CN5-2): CN5.2 U3.13(A1)
Net-(CN5-3): CN5.3 U3.12(B1)
Net-(CN5-4): CN5.4 U3.11(B2)
Net-(CN6-1): CN6.1 U2.14(A2)
Net-(CN6-2): CN6.2 U2.13(A1)
Net-(CN6-3): CN6.3 U2.12(B1)
Net-(CN6-4): CN6.4 U2.11(B2)
Net-(CN7-1): CN7.1 U7.14(A2)
Net-(CN7-2): CN7.2 U7.13(A1)
Net-(CN7-3): CN7.3 U7.12(B1)
Net-(CN7-4): CN7.4 U7.11(B2)
Net-(CN8-1): CN8.1 U8.14(A2)
Net-(CN8-2): CN8.2 U8.13(A1)
Net-(CN8-3): CN8.3 U8.12(B1)
Net-(CN8-4): CN8.4 U8.11(B2)
Net-(CN9-1): CN9.1 U9.14(A2)
Net-(CN9-2): CN9.2 U9.13(A1)
Net-(CN9-3): CN9.3 U9.12(B1)
Net-(CN9-4): CN9.4 U9.11(B2)
Net-(CN10-1): CN10.1 U10.14(A2)
Net-(CN10-2): CN10.2 U10.13(A1)
Net-(CN10-3): CN10.3 U10.12(B1)
Net-(CN10-4): CN10.4 U10.11(B2)
Net-(FUSE_3_3V-2): FUSE_3_3V.2 U15.3(OUT+)
Net-(FUSE_5V-2): FUSE_5V.2 U1.3(OUT+)
Net-(FUSE_24V-1): FUSE_24V.1 P11.2 U1.1(IN+)
Net-(FUSE_BED-1): FUSE_BED.1 P1.1 R40.2
Net-(FUSE_BED-2): FUSE_BED.2 P2.1
Net-(FUSE_CHAMBER-1): FUSE_CHAMBER.1 P4.1 R43.2
Net-(FUSE_CHAMBER-2): FUSE_CHAMBER.2 P3.1
Net-(FUSE_HEAT-2): FUSE_HEAT.2 P8.1
Net-(J9-2): J9.2 LED16.2 U19.13(OUT4)
Net-(J11-2): J11.2 LED15.2 U19.14(OUT3)
Net-(J12-2): J12.2 LED14.2 U19.15(OUT2)
Net-(J13-2): J13.2 LED13.2 U19.16(OUT1)
Net-(J16-2): J16.2 LED9.2 U18.13(OUT4)
Net-(J18-2): J18.2 LED10.2 U18.14(OUT3)
Net-(J19-2): J19.2 LED11.2 U18.15(OUT2)
Net-(J20-2): J20.2 LED12.2 U18.16(OUT1)
Net-(J36-2): J36.2 U7.2(MS1)
Net-(J36-4): J36.4 U7.3(MS2)
Net-(J37-2): J37.2 U8.2(MS1)
Net-(J37-4): J37.4 U8.3(MS2)
Net-(J38-2): J38.2 U9.2(MS1)
Net-(J38-4): J38.4 U9.3(MS2)
Net-(J39-2): J39.2 U10.2(MS1)
Net-(J39-4): J39.4 U10.3(MS2)
Net-(J40-2): J40.2 U2.2(MS1)
Net-(J40-4): J40.4 U2.3(MS2)
Net-(J41-2): J41.2 U3.2(MS1)
Net-(J41-4): J41.4 U3.3(MS2)
Net-(J42-2): J42.2 U4.2(MS1)
Net-(J42-4): J42.4 U4.3(MS2)
Net-(J43-2): J43.2 U5.2(MS1)
Net-(J43-4): J43.4 U5.3(MS2)
Net-(J44-1): J44.1 U5.6(CLK)
Net-(J45-1): J45.1 U4.6(CLK)
Net-(J46-1): J46.1 U3.6(CLK)
Net-(J47-1): J47.1 U2.6(CLK)
Net-(J48-1): J48.1 U7.6(CLK)
Net-(J49-1): J49.1 U8.6(CLK)
Net-(J50-1): J50.1 U9.6(CLK)
Net-(J51-1): J51.1 U10.6(CLK)
Net-(J52-1): J52.1 USB_SER.10(TX)
Net-(J52-2): J52.2 USB_SER.12(RX)
Net-(J53-1): J53.1 USB_SER.13(CTS)
Net-(J53-2): J53.2 USB_SER.11(RTS)
Net-(J55-1): J55.1 R47.2
Net-(LED1-1): LED1.1 R18.1
Net-(LED1-2): LED1.2 P15.2 Q1.2(D)
Net-(LED2-1): LED2.1 R19.1
Net-(LED2-2): LED2.2 P14.2 Q2.2(D)
Net-(LED3-1): LED3.1 R21.1
Net-(LED3-2): LED3.2 P13.2 Q3.2(D)
Net-(LED4-1): LED4.1 R23.1
Net-(LED4-2): LED4.2 P12.2 Q4.2(D)
Net-(LED5-1): LED5.1 R40.1
Net-(LED5-2): LED5.2 P1.2 Q6.2(D)
Net-(LED6-1): LED6.1 R43.1
Net-(LED6-2): LED6.2 P4.2 Q7.2(D)
Net-(LED9-1): LED9.1 R34.1
Net-(LED10-1): LED10.1 R36.1
Net-(LED11-1): LED11.1 R38.1
Net-(LED12-1): LED12.1 R39.1
Net-(LED13-1): LED13.1 R54.1
Net-(LED14-1): LED14.1 R55.1
Net-(LED15-1): LED15.1 R57.1
Net-(LED16-1): LED16.1 R59.1
Net-(LED17-1): LED17.1 R47.1
Net-(Q1-1): Q1.1(G) R11.2
Net-(Q2-1): Q2.1(G) R12.2
Net-(Q3-1): Q3.1(G) R13.2
Net-(Q4-1): Q4.1(G) R14.2
Net-(Q6-1): Q6.1(G) R37.2
Net-(Q7-1): Q7.1(G) R44.2
Net-(R27-1): R27.1 TXLED.1
Net-(R27-2): R27.2 USB_SER.5(GP7/TXLED)
Net-(R31-1): R31.1 R56.1 R60.2 SDCARD.2(CS)
Net-(R33-2): R33.2 USB_OTG.2
Net-(R35-2): R35.2 USB_OTG.3
Net-(R45-1): R45.1 RXLED.1
Net-(R45-2): R45.2 USB_SER.6(GP6/RXLED)
Net-(R46-1): R46.1 USB_SER.1(VDD)
Net-(R46-2): R46.2 R50.2 R51.1 USB_SER.4(RST)
Net-(R58-2): R58.2 R61.2 SDCARD.10(DET_A)
Net-(U15-1): U15.1(IN+) U16.1
Net-(USB-2): USB.2 USB_SER.18(D-)
Net-(USB-3): USB.3 USB_SER.19(D+)

Not connected (* = marked no-connect by the designer): SDCARD 1(NC)* 8(NC)*; U2 17(INDEX); U3 9(GND) 17(INDEX); U4 17(INDEX); U5 17(INDEX); U6 4(TAB); U7 17(INDEX); U8 17(INDEX); U9 17(INDEX); U10 17(INDEX); U18 5(IN5) 6(IN6) 7(IN7) 10(OUT7) 11(OUT6) 12(OUT5); U19 5(IN5) 6(IN6) 7(IN7) 10(OUT7) 11(OUT6) 12(OUT5); USB_OTG 1; USB_SER 7(GP5) 8(GP4) 9(GP3) 14(GP2) 15(GP1/USBCFG) 16(GP0/SSPND)
